# EAGLE design schema_mpb_1_1_Serial (EAGLE 9.0.1)
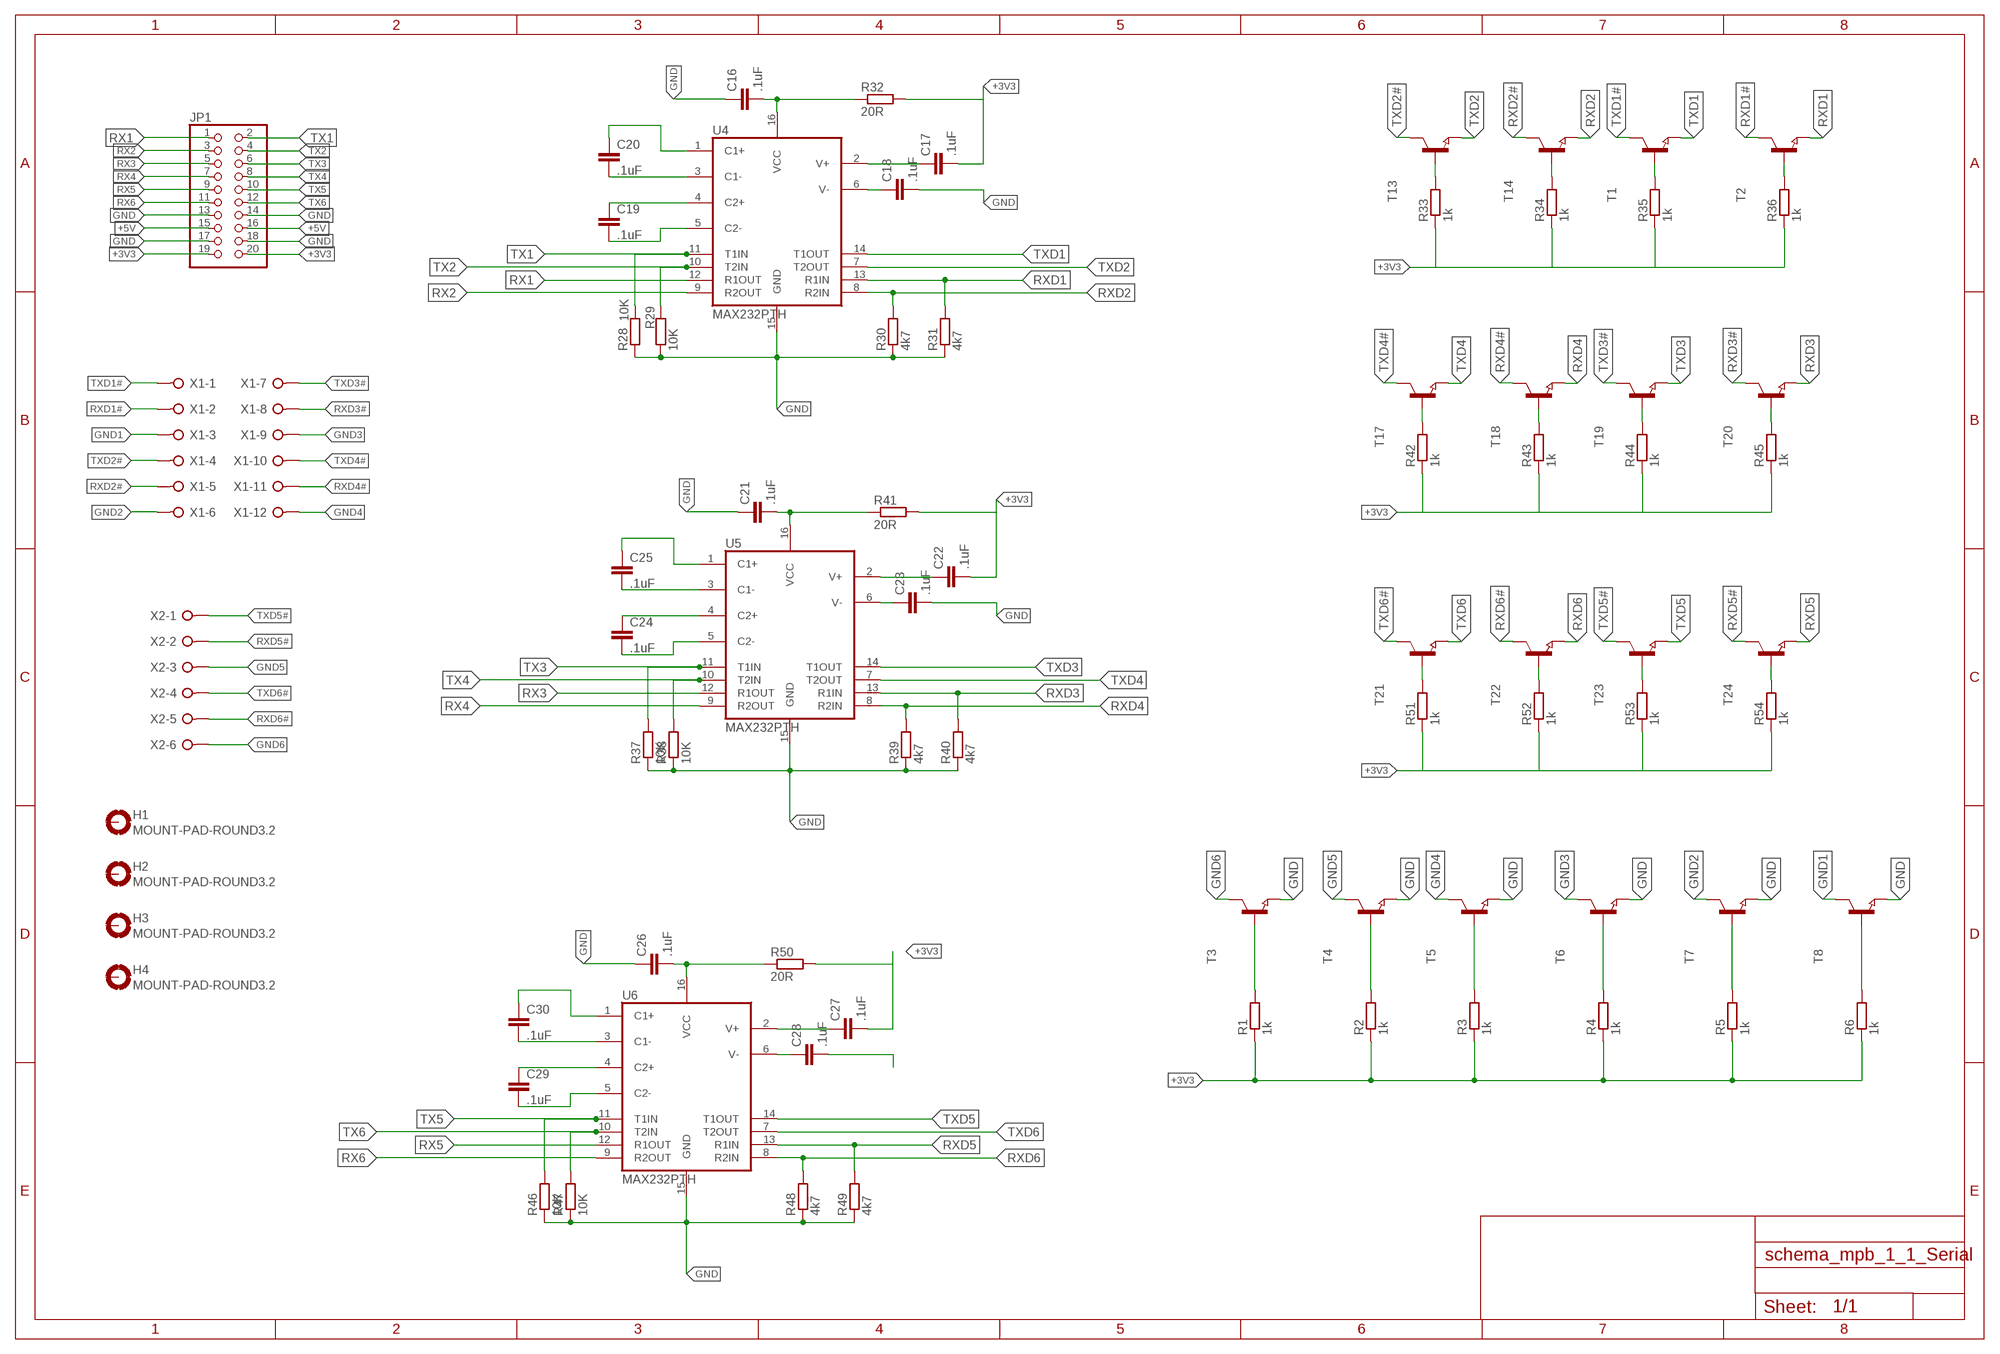
[diagram p0: schematic, sheet 1]

## Parts
C16  .1uF  C-EUC0603  [C0603]
C17  .1uF  C-EUC0603  [C0603]
C18  .1uF  C-EUC0603  [C0603]
C19  .1uF  C-EUC0603  [C0603]
C20  .1uF  C-EUC0603  [C0603]
C21  .1uF  C-EUC0603  [C0603]
C22  .1uF  C-EUC0603  [C0603]
C23  .1uF  C-EUC0603  [C0603]
C24  .1uF  C-EUC0603  [C0603]
C25  .1uF  C-EUC0603  [C0603]
C26  .1uF  C-EUC0603  [C0603]
C27  .1uF  C-EUC0603  [C0603]
C28  .1uF  C-EUC0603  [C0603]
C29  .1uF  C-EUC0603  [C0603]
C30  .1uF  C-EUC0603  [C0603]
H1  MOUNT-PAD-ROUND3.2  [3,2-PAD]
H2  MOUNT-PAD-ROUND3.2  [3,2-PAD]
H3  MOUNT-PAD-ROUND3.2  [3,2-PAD]
H4  MOUNT-PAD-ROUND3.2  [3,2-PAD]
JP1  PINHD-2X10  [2X10]
R1  1k  R-EU_R0603  [R0603]
R2  1k  R-EU_R0603  [R0603]
R3  1k  R-EU_R0603  [R0603]
R4  1k  R-EU_R0603  [R0603]
R5  1k  R-EU_R0603  [R0603]
R6  1k  R-EU_R0603  [R0603]
R28  10K  R-EU_R0603  [R0603]
R29  10K  R-EU_R0603  [R0603]
R30  4k7  R-EU_R0603  [R0603]
R31  4k7  R-EU_R0603  [R0603]
R32  20R  R-EU_R0603  [R0603]
R33  1k  R-EU_R0603  [R0603]
R34  1k  R-EU_R0603  [R0603]
R35  1k  R-EU_R0603  [R0603]
R36  1k  R-EU_R0603  [R0603]
R37  10K  R-EU_R0603  [R0603]
R38  10K  R-EU_R0603  [R0603]
R39  4k7  R-EU_R0603  [R0603]
R40  4k7  R-EU_R0603  [R0603]
R41  20R  R-EU_R0603  [R0603]
R42  1k  R-EU_R0603  [R0603]
R43  1k  R-EU_R0603  [R0603]
R44  1k  R-EU_R0603  [R0603]
R45  1k  R-EU_R0603  [R0603]
R46  10K  R-EU_R0603  [R0603]
R47  10K  R-EU_R0603  [R0603]
R48  4k7  R-EU_R0603  [R0603]
R49  4k7  R-EU_R0603  [R0603]
R50  20R  R-EU_R0603  [R0603]
R51  1k  R-EU_R0603  [R0603]
R52  1k  R-EU_R0603  [R0603]
R53  1k  R-EU_R0603  [R0603]
R54  1k  R-EU_R0603  [R0603]
T1  NPN-TRANSISTOR_SOT23  [SOT23]
T2  NPN-TRANSISTOR_SOT23  [SOT23]
T3  NPN-TRANSISTOR_SOT23  [SOT23]
T4  NPN-TRANSISTOR_SOT23  [SOT23]
T5  NPN-TRANSISTOR_SOT23  [SOT23]
T6  NPN-TRANSISTOR_SOT23  [SOT23]
T7  NPN-TRANSISTOR_SOT23  [SOT23]
T8  NPN-TRANSISTOR_SOT23  [SOT23]
T13  NPN-TRANSISTOR_SOT23  [SOT23]
T14  NPN-TRANSISTOR_SOT23  [SOT23]
T17  NPN-TRANSISTOR_SOT23  [SOT23]
T18  NPN-TRANSISTOR_SOT23  [SOT23]
T19  NPN-TRANSISTOR_SOT23  [SOT23]
T20  NPN-TRANSISTOR_SOT23  [SOT23]
T21  NPN-TRANSISTOR_SOT23  [SOT23]
T22  NPN-TRANSISTOR_SOT23  [SOT23]
T23  NPN-TRANSISTOR_SOT23  [SOT23]
T24  NPN-TRANSISTOR_SOT23  [SOT23]
U4  MAX232PTH  [DIL16]
U5  MAX232PTH  [DIL16]
U6  MAX232PTH  [DIL16]
X1  W237-12P  [W237-12P]
X2  W237-06P  [W237-6P]

## Nets
+3V3: C17.2 C22.2 C27.2 JP1.19 JP1.20 R1.1 R2.1 R3.1 R4.1 R5.1 R6.1 R32.2 R33.1 R34.1 R35.1 R36.1 R41.2 R42.1 R43.1 R44.1 R45.1 R50.2 R51.1 R52.1 R53.1 R54.1
+5V: JP1.15 JP1.16
GND [gnd]: C16.1 C18.2 C21.1 C23.2 C26.1 C28.2 JP1.13 JP1.14 JP1.17 JP1.18 R28.1 R29.1 R30.1 R31.1 R37.1 R38.1 R39.1 R40.1 R46.1 R47.1 R48.1 R49.1 T3.2(E) T4.2(E) T5.2(E) T6.2(E) T7.2(E) T8.2(E) U4.15(GND) U5.15(GND) U6.15(GND)
GND1: T8.3(C) X1.3
GND2: T7.3(C) X1.6
GND3: T6.3(C) X1.9
GND4: T5.3(C) X1.12
GND5: T4.3(C) X2.3
GND6: T3.3(C) X2.6
N$1: R1.2 T3.1(B)
N$2: R2.2 T4.1(B)
N$3: R3.2 T5.1(B)
N$4: R4.2 T6.1(B)
N$5: R5.2 T7.1(B)
N$6: R6.2 T8.1(B)
N$34: C20.2 U4.3(C1-)
N$35: C20.1 U4.1(C1+)
N$36: C19.2 U4.5(C2-)
N$37: C19.1 U4.4(C2+)
N$38: C18.1 U4.6(V-)
N$39: C16.2 R32.1 U4.16(VCC)
N$40: C17.1 U4.2(V+)
N$41: R33.2 T13.1(B)
N$42: R34.2 T14.1(B)
N$43: R35.2 T1.1(B)
N$44: R36.2 T2.1(B)
N$45: C25.2 U5.3(C1-)
N$46: C25.1 U5.1(C1+)
N$47: C24.2 U5.5(C2-)
N$48: C24.1 U5.4(C2+)
N$49: C23.1 U5.6(V-)
N$50: C21.2 R41.1 U5.16(VCC)
N$51: C22.1 U5.2(V+)
N$52: R42.2 T17.1(B)
N$53: R43.2 T18.1(B)
N$54: R44.2 T19.1(B)
N$55: R45.2 T20.1(B)
N$56: C30.2 U6.3(C1-)
N$57: C30.1 U6.1(C1+)
N$58: C29.2 U6.5(C2-)
N$59: C29.1 U6.4(C2+)
N$60: C28.1 U6.6(V-)
N$61: C26.2 R50.1 U6.16(VCC)
N$62: C27.1 U6.2(V+)
N$63: R51.2 T21.1(B)
N$64: R52.2 T22.1(B)
N$65: R53.2 T23.1(B)
N$66: R54.2 T24.1(B)
RX1: JP1.1 U4.12(R1OUT)
RX2: JP1.3 U4.9(R2OUT)
RX3: JP1.5 U5.12(R1OUT)
RX4: JP1.7 U5.9(R2OUT)
RX5: JP1.9 U6.12(R1OUT)
RX6: JP1.11 U6.9(R2OUT)
RXD1: R31.2 T2.2(E) U4.13(R1IN)
RXD1#: T2.3(C) X1.2
RXD2: R30.2 T14.2(E) U4.8(R2IN)
RXD2#: T14.3(C) X1.5
RXD3: R40.2 T20.2(E) U5.13(R1IN)
RXD3#: T20.3(C) X1.8
RXD4: R39.2 T18.2(E) U5.8(R2IN)
RXD4#: T18.3(C) X1.11
RXD5: R49.2 T24.2(E) U6.13(R1IN)
RXD5#: T24.3(C) X2.2
RXD6: R48.2 T22.2(E) U6.8(R2IN)
RXD6#: T22.3(C) X2.5
TX1: JP1.2 R28.2 U4.11(T1IN)
TX2: JP1.4 R29.2 U4.10(T2IN)
TX3: JP1.6 R37.2 U5.11(T1IN)
TX4: JP1.8 R38.2 U5.10(T2IN)
TX5: JP1.10 R46.2 U6.11(T1IN)
TX6: JP1.12 R47.2 U6.10(T2IN)
TXD1: T1.2(E) U4.14(T1OUT)
TXD1#: T1.3(C) X1.1
TXD2: T13.2(E) U4.7(T2OUT)
TXD2#: T13.3(C) X1.4
TXD3: T19.2(E) U5.14(T1OUT)
TXD3#: T19.3(C) X1.7
TXD4: T17.2(E) U5.7(T2OUT)
TXD4#: T17.3(C) X1.10
TXD5: T23.2(E) U6.14(T1OUT)
TXD5#: T23.3(C) X2.1
TXD6: T21.2(E) U6.7(T2OUT)
TXD6#: T21.3(C) X2.4
Unconnected: H1.B3,2(MOUNT) H2.B3,2(MOUNT) H3.B3,2(MOUNT) H4.B3,2(MOUNT)

## Library data of the parts
C16-C30 = rcl:C-EU: CAPACITOR, European symbol; SPICEPREFIX: C
H1-H4 = holes:MOUNT-PAD-ROUND: MOUNTING PAD, round
JP1 = pinhead:PINHD-2X10: PIN HEADER
R1-R6 R28-R54 = rcl:R-EU_: RESISTOR, European symbol; SPICEPREFIX: R
T1-T8 T13 T14 T17-T24 = semicon-smd-ipc:NPN-TRANSISTOR_: NPN TRANSISTOR
U4-U6 = SparkFun-DigitalIC:MAX232: RS232 Transceiver Very common IC. This is generically called 'MAX232', but works with the 3V equivalent MAX3232 generic ICs. Field tested and mother approved. Spark Fun Electronics SKU : COM-00316 (DIP) and COM-00589 (SMD)
X1 = con-wago-508:W237-12P: WAGO SREW CLAMP; OC_FARNELL: unknown; OC_NEWARK: unknown
X2 = con-wago-508:W237-06P: WAGO SREW CLAMP; OC_FARNELL: unknown; OC_NEWARK: unknown

## Net classes
1 power: width 0.152 mm, drill 0.152 mm, clearance 0.152 mm
2 gnd: width 0.152 mm, drill 0.152 mm, clearance 0.152 mm

## Board
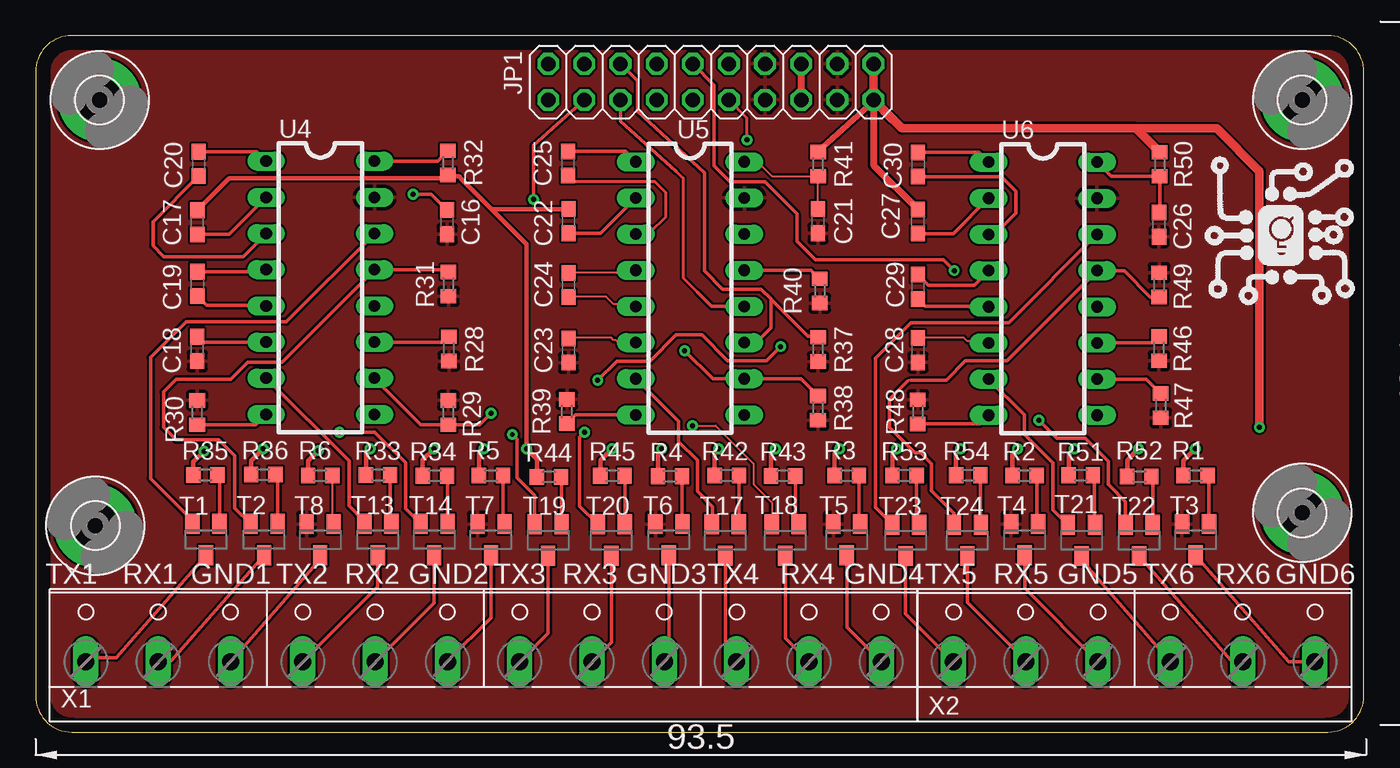
[diagram p1: board, top side]
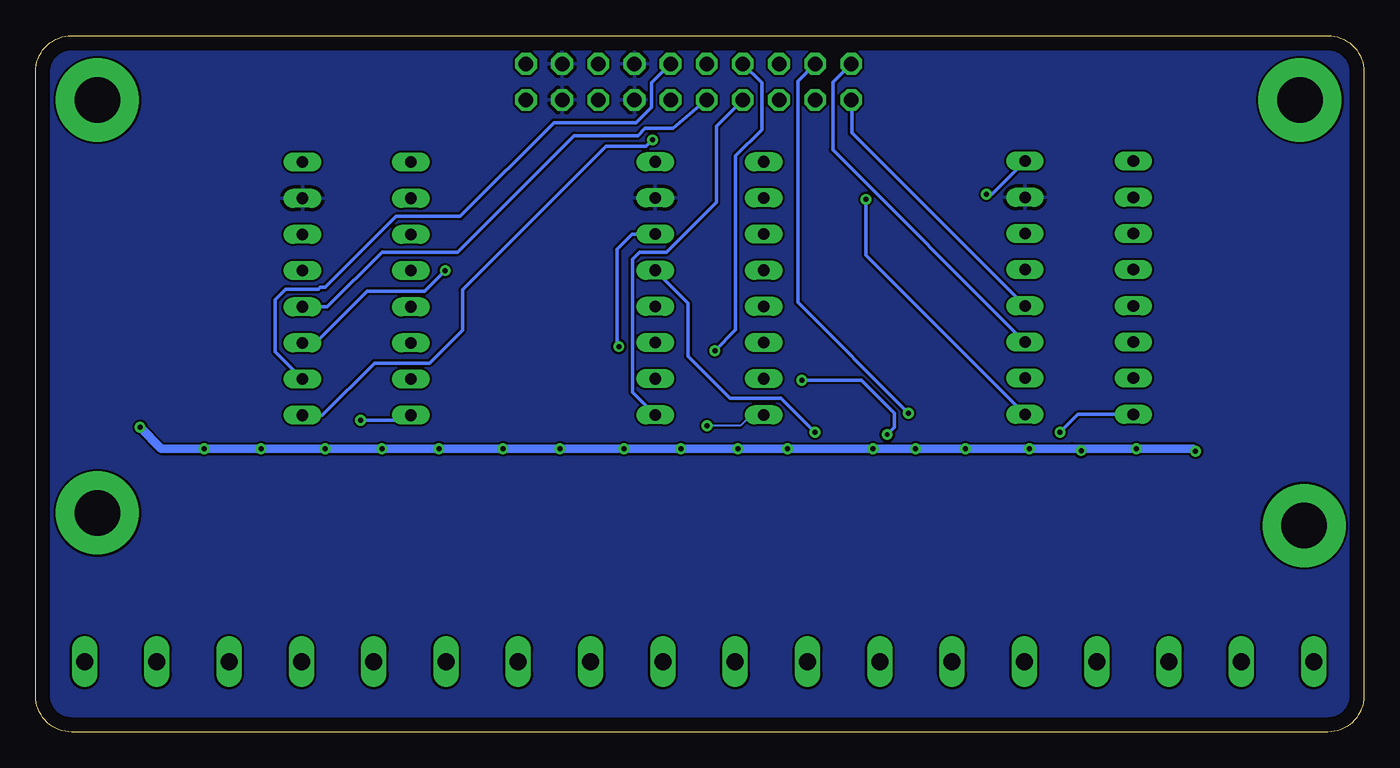
[diagram p2: board, bottom side, seen from below]

Size 93.34 x 48.92 mm. Coordinates in mm from the lower left corner, seen from the top.
Outline: 90.8,48.92 2.54,48.92 arc90 0,46.38 0,2.54 arc90 2.54,0 90.8,0 arc90 93.34,2.54 93.34,46.38 arc90 90.8,48.92
Copper layers (1*16): Top 0.035mm / dielectric 1.5mm / Bottom 0.035mm
Design rules "default": minimum track width 6mil, minimum drill 0.35mm, track to track 6mil, track to pad 6mil, pad to pad 6mil, via to via 6mil, smd to smd 6mil, copper to edge 40mil, drill to drill 6mil, minimum pad ring 10mil, minimum via ring 8mil, stop-mask expansion 4mil, vias tented up to drill 0mil, thermal gap 10mil

### Footprints (pad centres in the part's own frame; a part is rotated, then mirrored left to right if it is on the bottom)
C0603 = smd 1.1 x 1: 1 -0.85,0; 2 0.85,0
3,2-PAD = drill 3.2 pad 5.842: B3,2 0,0
2X10 = drill 1.016 octagon: 1 -11.43,-1.27; 2 -11.43,1.27; 3 -8.89,-1.27; 4 -8.89,1.27; 5 -6.35,-1.27; 6 -6.35,1.27; 7 -3.81,-1.27; 8 -3.81,1.27; 9 -1.27,-1.27; 10 -1.27,1.27; 11 1.27,-1.27; 12 1.27,1.27; 13 3.81,-1.27; 14 3.81,1.27; 15 6.35,-1.27; 16 6.35,1.27; 17 8.89,-1.27; 18 8.89,1.27; 19 11.43,-1.27; 20 11.43,1.27
R0603 = smd 1 x 1.1: 1 -0.85,0; 2 0.85,0
SOT23 = smd 1 x 1.4: 1 -0.95,-1.1; 2 0.95,-1.1; 3 0,1.1
DIL16 = drill 0.813 long: 1 -8.89,-3.81; 2 -6.35,-3.81; 3 -3.81,-3.81; 4 -1.27,-3.81; 5 1.27,-3.81; 6 3.81,-3.81; 7 6.35,-3.81; 8 8.89,-3.81; 9 8.89,3.81; 10 6.35,3.81; 11 3.81,3.81; 12 1.27,3.81; 13 -1.27,3.81; 14 -3.81,3.81; 15 -6.35,3.81; 16 -8.89,3.81
W237-12P = drill 1.194 long: 1 -27.94,-0.635; 2 -22.86,-0.635; 3 -17.78,-0.635; 4 -12.7,-0.635; 5 -7.62,-0.635; 6 -2.54,-0.635; 7 2.54,-0.635; 8 7.62,-0.635; 9 12.7,-0.635; 10 17.78,-0.635; 11 22.86,-0.635; 12 27.94,-0.635
W237-6P = drill 1.194 long: 1 -12.7,-0.635; 2 -7.62,-0.635; 3 -2.54,-0.635; 4 2.54,-0.635; 5 7.62,-0.635; 6 12.7,-0.635

### Placement (x,y rotation side)
C16  28.92,35.82 90 top
C17  11.37,35.8 90 top
C18  11.35,26.91 270 top
C19  11.37,31.48 270 top
C20  11.45,39.91 270 top
C21  54.98,35.89 90 top
C22  37.45,35.88 90 top
C23  37.46,26.8 270 top
C24  37.46,31.4 270 top
C25  37.41,39.94 270 top
C26  78.94,35.64 90 top
C27  61.99,35.86 90 top
C28  61.99,26.82 270 top
C29  62,31.28 270 top
C30  62.01,39.87 270 top
H1  4.2,14.5 90 top
H2  89,15.4 90 top
H3  4.5,44.4 90 top
H4  89,44.4 90 top
JP1  47.45,45.67 0 top
R1  81.5,18.01 0 top
R2  69.5,18.01 0 top
R3  57,18.01 0 top
R4  44.58,17.97 0 top
R5  32,18.01 0 top
R6  20,18.01 0 top
R28  29.04,26.91 90 top
R29  29,22.44 270 top
R30  11.35,22.44 270 top
R31  29.01,31.46 90 top
R32  28.98,39.97 270 top
R33  24.06,18.05 0 top
R34  28.06,18.01 0 top
R35  11.93,18.06 0 top
R36  16,18.08 0 top
R37  54.98,26.87 90 top
R38  54.98,22.75 90 top
R39  37.33,22.51 270 top
R40  55.1,30.98 90 top
R41  54.98,39.9 90 top
R42  48.57,18.02 0 top
R43  52.53,18 0 top
R44  36.08,17.92 0 top
R45  40.54,18 0 top
R46  78.94,26.93 90 top
R47  79.06,22.93 90 top
R48  61.99,22.49 270 top
R49  78.95,31.4 270 top
R50  78.99,39.88 90 top
R51  73.45,18.04 0 top
R52  77.55,17.94 0 top
R53  61.06,18.02 0 top
R54  65.53,18.04 0 top
T1  11.97,13.52 180 top
T2  16.06,13.52 180 top
T3  81.51,13.51 180 top
T4  69.5,13.51 180 top
T5  57,13.51 180 top
T6  44.5,13.51 180 top
T7  32,13.51 180 top
T8  20,13.51 180 top
T13  24.05,13.52 180 top
T14  28.01,13.52 180 top
T17  48.47,13.48 180 top
T18  52.68,13.48 180 top
T19  36.01,13.48 180 top
T20  40.46,13.48 180 top
T21  73.5,13.46 180 top
T22  77.54,13.46 180 top
T23  61.14,13.46 180 top
T24  65.48,13.46 180 top
U4  20.01,31.21 270 top
U5  45.99,31.17 270 top
U6  70.78,31.14 270 top
X1  31.48,5.58 0 top
X2  77.2,5.58 0 top

### Tracks (layer width: path | path; a pad name or v marks a point on that pad's centre or on a via)
+3V3  (via drill 0.35)
  Top 0.152: 25.5,38.89 28.74,38.89 28.87,39.03 28.96,39.12 R32.2 29.04,39.12 29.19,38.97 29.8,38.97 29.93,38.84 32.01,36.76 | 37.42,36.76 C22.2 | 61.96,36.76 C27.2 | 34.6,20.37 34.38,20.14 v34.5,19.9
  Top 0.305: R35.1 11.08,18.98 v11.83,19.73 | R36.1 15.15,19.05 v16,19.9 | R6.1 19.15,19.05 v19.87,19.77 | R33.1 23.21,19.61 v23.5,19.9 | R34.1 27.21,19.11 v28,19.9 | R5.1 31.15,19.55 v31.5,19.9 | R44.1 35.23,19.17 v34.5,19.9 34.5,34.27 32.04,36.73 | 28.87,39.03 29.74,39.03 29.93,38.84 32.04,36.73 | 32.04,36.73 C22.2 | C17.2 13.6,38.89 25.5,38.89 | R45.1 39.69,19.09 v40.5,19.9 | R4.1 43.73,19.63 v44,19.9 | R42.1 47.72,19.62 v48,19.9 | R43.1 51.68,19.58 v52,19.9 | R3.1 56.15,19.55 v56.5,19.9 | R53.1 60.21,19.61 v60.5,19.9 | R54.1 64.68,19.58 v65,19.9 | R2.1 68.65,19.55 v69,19.9 | R51.1 72.6,19.5 v73,19.9 | R52.1 76.7,19.1 v77.5,19.9 | R1.1 80.65,19.05 v81.5,19.9 | R32.2 28.74,38.89 25,38.89
  Top 0.406: R41.2 58.88,44.26 JP1.19
  Top 0.508: JP1.19 58.88,39.82 C27.2
  Top 0.61: JP1.20 JP1.19 | JP1.19 60.26,43.02 | v86,21.4 86,39.4 83,42.4 77.32,42.4 | R50.2 77.32,42.4 | JP1.19 60.88,42.4 77.32,42.4
  Bottom 0.305: v11.83,19.73 12,19.9 | v19.87,19.77 20,19.9 20.5,19.9
  Bottom 0.61: v86,21.4 84.5,19.9 v81.5,19.9 v77.5,19.9 v73,19.9 v69,19.9 v65,19.9 v60.5,19.9 v56.5,19.9 v52,19.9 v48,19.9 v44,19.9 v40.5,19.9 v34.5,19.9 v31.5,19.9 v28,19.9 v23.5,19.9 20.5,19.9 v16,19.9 12,19.9
+5V
  Top 0.508: JP1.15 JP1.16
GND
  pour Bottom: 93.2,46.25 93.2,2.67 arc-90 90.66,0.13 2.65,0.13 arc-90 0.11,2.67 0.11,46.25 arc-90 2.65,48.79 90.66,48.79 arc-90
  pour Top: 93.2,46.25 93.2,2.67 arc-90 90.66,0.13 2.65,0.13 arc-90 0.11,2.67 0.11,46.25 arc-90 2.65,48.79 90.66,48.79 arc-90
GND1
  Top 0.254: T8.3 20,12.14 X1.3
GND2
  Top 0.152: 28.96,5 X1.6
  Top 0.254: T7.3 32,8.03 28.96,5
GND3
  Top 0.254: T6.3 44.5,5.27 X1.9
GND4
  Top 0.254: T5.3 57,7.37 X1.12
GND5
  Top 0.254: T4.3 69.5,10.11 X2.3
GND6
  Top 0.254: T3.3 88.07,4.95 X2.6
N$1
  Top 0.254: R1.2 82.46,17.9 T3.1
N$2
  Top 0.254: R2.2 70.35,14.71 T4.1
N$3
  Top 0.254: R3.2 57.85,14.71 T5.1
N$4
  Top 0.152: 45.42,14.9 45.42,14.66 T6.1
  Top 0.254: R4.2 45.42,14.9
N$5
  Top 0.152: 32.85,14.74 32.93,14.66 T7.1
  Top 0.254: R5.2 32.85,14.74
N$6
  Top 0.152: R6.2 20.89,17.93 20.89,14.66 T8.1
N$34
  Top 0.152: 11.44,39.04 C20.2 | 14.5,33.4 14.56,33.4
  Top 0.254: C20.2 8.25,35.85 8.25,34.15 9,33.4 14.5,33.4 | 14.56,33.4 14.58,33.4 U4.3
N$35
  Top 0.254: C20.1 15.54,40.76 U4.1
N$36
  Top 0.152: 16.16,29.97 U4.5
  Top 0.254: C19.2 12.03,29.97 16.16,29.97
N$37
  Top 0.254: C19.1 16.06,32.33 U4.4
N$38
  Top 0.254: U4.6 11.72,27.4 C18.1
N$39  (via drill 0.35)
  Top 0.152: 24,40.11 23.86,40.11 U4.16
  Top 0.254: R32.1 28.26,40.11 24,40.11 | C16.2 28.86,36.7 27.79,37.78 v26.53,37.78
  Bottom 0.254: U4.16 26.14,37.78 v26.53,37.78
N$40
  Top 0.254: C17.1 13.6,34.95 U4.2
N$41
  Top 0.254: R33.2 24.91,14.71 T13.1
N$42
  Top 0.152: 28.89,17.93 R34.2
  Top 0.254: T14.1 28.96,17.86 28.89,17.93
N$43
  Top 0.254: R35.2 12.92,17.92 T1.1
N$44
  Top 0.152: 17,14.66 T2.1
  Top 0.254: R36.2 17,17.93 17,14.66
N$45
  Top 0.152: 42.22,35.16 42.22,35 U5.3
  Top 0.2: 42.31,35.09 43.19,35.09 44.25,36.15 44.25,37.93 43.5,38.68 37.82,38.68 C25.2
  Top 0.254: 42.31,35.09 42.22,35
N$46
  Top 0.254: C25.1 41.45,40.79 U5.1
N$47
  Top 0.152: C24.2 37.5,30.58 40.09,30.58 40.62,30.05 40.85,30.05 41.01,29.9 42.15,29.9 U5.5
N$48
  Top 0.152: C24.1 37.5,32.26 40.85,32.26 41.01,32.41 42.15,32.41 U5.4
N$49
  Top 0.152: C23.1 37.5,27.69 40.47,27.69 40.62,27.54 40.78,27.54 40.93,27.38 42.15,27.38 U5.6
N$50
  Top 0.152: C21.2 54.95,36.76 54.95,39.04 R41.1 54.87,39.04 51.75,39.04 50.76,40.03 49.84,40.03 U5.16
N$51
  Top 0.254: C22.1 39.7,35.03 U5.2
N$52
  Top 0.254: R42.2 T17.1
N$53
  Top 0.254: R43.2 53.38,14.83 T18.1
N$54
  Top 0.152: T19.1
  Top 0.254: R44.2 36.97,17.88 T19.1
N$55
  Top 0.254: R45.2 41.41,17.98 T20.1
N$56
  Top 0.152: 67.45,35 66.99,35 U6.3
  Top 0.254: C30.2 67.86,39.02 68.89,37.98 68.89,36.45 67.45,35
N$57
  Top 0.254: C30.1 66.29,40.71 U6.1
N$58
  Top 0.152: 66.91,29.9 U6.5
  Top 0.254: C29.2 62.53,29.9 66.91,29.9
N$59
  Top 0.254: 62.37,31.76 C29.1 62.73,31.4 65.96,31.4 U6.4
N$60
  Top 0.152: C28.1 62.04,27.69 65.24,27.69 65.47,27.46 66.84,27.46 66.91,27.38 U6.6
N$61
  Top 0.254: U6.16 75.59,39.03 R50.1 78.99,36.54 C26.2
N$62
  Top 0.152: 66.91,37.44 U6.2
  Top 0.254: C27.1 64.48,35.01 66.91,37.44
N$63
  Top 0.152: 74.41,14.57 T21.1
  Top 0.254: R51.2 74.41,17.92 74.41,14.57
N$64
  Top 0.254: R52.2 78.49,17.85 T22.1
N$65
  Top 0.254: R53.2 61.91,14.74 T23.1
N$66
  Top 0.152: 66.38,14.58 T24.1
  Top 0.254: R54.2 66.38,14.59 66.38,14.58
RX1
  Bottom 0.152: 35.98,44.38 JP1.1
  Bottom 0.254: U4.12 35.98,42.09 35.98,44.38
RX2  (via drill 0.35)
  Top 0.254: v35,37.41 35,41.22 JP1.3
  Bottom 0.254: v35,37.41 35,33.5 U4.9
RX3
  Top 0.2: 45,39.4 45.5,38.9 45.5,31.9 46.5,30.9
  Top 0.254: JP1.5 41.1,42.92 45,39.4 | U5.12 47.5,29.9 46.5,30.9
RX4
  Bottom 0.152: 43.67,44.38 JP1.7
  Bottom 0.254: U5.9 51.4,23.88 51.4,33.22 50.91,33.71 49,33.71 45.5,37.21 45.5,42.55 43.67,44.38
RX5
  Bottom 0.254: U6.12 72.84,29.87 69,33.71 63.69,33.71 55.5,41.9 51,41.9 50.5,42.4 48.56,42.4 JP1.9
RX6  (via drill 0.35)
  Top 0.2: v49.99,41.59 49.99,43.13 JP1.11
  Bottom 0.254: U6.9 73.19,22.25 69.52,25.92 65.66,25.92 63.34,28.24 63.34,31.06 53.25,41.15 50.43,41.15 v49.99,41.59
RXD1
  Top 0.254: T2.2 14,15.73 14,19.4 12.87,20.53 9.87,20.53 9,21.4 9,23.9 9.89,24.79 13.72,24.79 14.92,25.98 17.33,25.98 U4.13 28.85,32.48 R31.2
RXD1#
  Top 0.152: 8.62,5 X1.2
  Top 0.254: T2.3 9.53,5 8.62,5
RXD2  (via drill 0.35)
  Top 0.254: R30.2 15.48,21.59 U4.8 | v21.36,21.06 23.84,21.06 26,18.9 26,15.68 T14.2
  Bottom 0.254: U4.8 20.1,22.32 v21.36,21.06
RXD2#
  Top 0.254: T14.3 28.01,9.1 X1.5
RXD3  (via drill 0.35)
  Top 0.254: v38.57,21.06 38.21,20.7 38.21,15.88 T20.2 | U5.13 54.5,32.44 R40.2
  Bottom 0.254: U5.13 47.5,30.14 47.5,26.4 44.55,23.45 40.95,23.45 v38.57,21.06
RXD3#
  Top 0.254: T20.3 40.46,6.3 X1.8
RXD4  (via drill 0.35)
  Top 0.152: v46.16,21.52 47.79,21.52 50.45,18.85 50.45,17.4 51.75,16.11 51.75,14.58 T18.2
  Top 0.254: R39.2 37.94,22.28 U5.8
  Bottom 0.152: v46.16,21.52 43.82,21.52 43.37,21.97 42.45,21.97 42.22,22.2 U5.8
RXD4#
  Top 0.254: T18.3 52.68,6.61 X1.11
RXD5
  Top 0.152: 74.61,32.34 75.6,32.34 | 78.88,30.58 R49.2 | 61.27,24.63 61.35,24.72 61.5,24.72 | 65.83,26.07 65.85,26.09 68.36,26.09 74.61,32.34 | 74.61,32.34 U6.13
  Top 0.254: 61.5,24.72 64,24.72 65.35,26.07 65.83,26.07 68.25,26.07 U6.13 74.6,32.4 76.5,32.4 78.35,30.55 R49.2 | 61.27,24.63 60,23.37 60,21.4 61.8,19.6 62.2,19.6 62.95,18.85 62.95,16.95 64.53,15.37 T24.2
RXD5#
  Top 0.152: 69.58,5 X2.2
  Top 0.254: T24.3 65.48,9.1 69.58,5
RXD6  (via drill 0.35)
  Top 0.152: 76.59,14.9 76.59,14.58 T22.2 | 75.37,17.4 75.44,17.34
  Top 0.254: R48.2 66.36,21.64 U6.8 | 75.44,17.34 76.59,16.18 76.59,14.9 | v70.5,21.9 71.75,20.65 73.75,20.65 75.37,19.03 75.37,17.4
  Bottom 0.254: U6.8 67.32,21.9 v70.5,21.9
RXD6#
  Top 0.152: 84.82,5 X2.5
  Top 0.254: T22.3 84.01,5 84.82,5
TX1
  Top 0.152: R28.2
  Top 0.254: U4.11 28.67,27.4 R28.2
  Bottom 0.254: U4.11 37.32,40.9 37.32,45.64 JP1.2
TX2  (via drill 0.35)
  Top 0.152: 23.86,24.79 U4.10
  Top 0.254: v32,22.4 31.19,21.59 R29.2 27.06,21.59 23.86,24.79
  Bottom 0.254: JP1.4 39.79,45.71 39.79,30.19 v32,22.4
TX3
  Top 0.152: 54.95,27.69 R37.2 | 49.84,27.38 U5.11 | 51.67,30.43 51.67,30.4
  Top 0.254: JP1.6 42.3,45.74 42.3,43.62 47,39.3 47,32.4 48.28,31.12 50.99,31.12 51.67,30.43 | U5.11 50.63,27.36 51.67,28.4 51.67,30.4 54.27,27.8 54.9,27.8 | 54.8,27.9 54.9,27.8 | 54.9,27.8 R37.2
TX4  (via drill 0.35)
  Top 0.254: v45.61,26.79 47.58,24.82 U5.10 53.77,24.82 R38.2
  Bottom 0.152: 42.3,42.32 44.2,40.41 44.2,37.9 | 43.62,46.91 JP1.8
  Bottom 0.254: v45.61,26.79 44.16,28.24 44.16,40.46 42.3,42.32 42.3,45.6 43.62,46.91
TX5  (via drill 0.35)
  Top 0.254: JP1.10 47.68,45.44 47.68,39.76 48.8,38.64 51.24,38.64 53.49,36.39 53.49,34.48 54.79,33.18 63.78,33.18 v64.55,32.41 | U6.11 78.49,27.33 R46.2
  Bottom 0.152: 74.53,27.38 U6.11
  Bottom 0.254: v64.55,32.41 66.01,30.95 70.05,30.95 73.62,27.38 74.53,27.38
TX6
  Top 0.254: U6.10 78.05,24.79 R47.2
  Bottom 0.254: JP1.12 50.05,45.61 50.05,43.9 51.14,42.81 56.92,42.81 63.5,36.22 68,36.22 72.98,31.24 73.34,31.24 73.47,31.12 75.5,31.12 75.75,31.12 76.51,30.36 76.51,26.72 U6.10
TXD1
  Top 0.152: 10.98,14.9 10.98,14.66 T1.2
  Top 0.254: U4.14 17.62,28.81 10.59,28.81 8.09,26.32 8.09,17.8 10.98,14.9
TXD1#
  Top 0.152: 3.59,5 X1.1
  Top 0.254: 3.59,5 3.8,5.2 5.65,5.2 T1.3
TXD2
  Top 0.254: T13.2 23.1,14.82 22.02,15.9 22.02,19.04 U4.7
TXD2#
  Top 0.254: T13.3 24.05,10.22 X1.4
TXD3  (via drill 0.35)
  Top 0.152: 52.34,27.06 v52.36,27.08
  Top 0.254: T19.2 35.06,16.64 33.84,17.86 33.84,20.56 v33.5,20.9 | v39.5,24.72 40.84,26.06 43.16,26.06 45,27.9 46.81,27.9 48.62,26.09 51.37,26.09 52.34,27.06
  Bottom 0.254: v33.5,20.9 33,21.4 33,22.4 35.32,24.72 v39.5,24.72 | U5.14 51.42,34.98 52.5,33.9 52.5,27.22 v52.36,27.08
TXD3#
  Top 0.254: T19.3 36.01,6.94 X1.7
TXD4
  Top 0.152: 47.56,14.58 T17.2
  Top 0.254: U5.7 45.18,21.81 45.18,20.4 46.5,19.08 46.5,16.9 47.56,15.84 47.56,14.58
TXD4#
  Top 0.254: T17.3 48.47,5.74 X1.10
TXD5
  Top 0.152: 60.21,14.58 T23.2
  Top 0.254: U6.14 68.39,28.76 61.5,28.76 59,26.26 59,15.79 60.21,14.58
TXD5#
  Top 0.254: T23.3 61.14,8.31 X2.1
TXD6
  Top 0.254: U6.7 69.49,22.27 69.49,20.9 70.99,19.39 71.49,18.9 71.5,18.9 71.5,15.61 71.61,15.51 T21.2
TXD6#
  Top 0.254: T21.3 73.5,12.09 X2.4

### Text on the board
tPlace: TX1 | RX1 | GND1 | TX2 | RX2 | GND2 | TX3 | RX3 | GND3 | TX4 | RX4 | GND4 | TX5 | RX5 | GND5 | TX6 | RX6 | GND6